# Altium schematic sheet bigMama.SchDoc: bigMama constant current breakout
size A4; DrawnBy: dermitza; Revision: 0.2; SheetNumber: 1; SheetTotal: 1; DocumentFullPathAndName: -
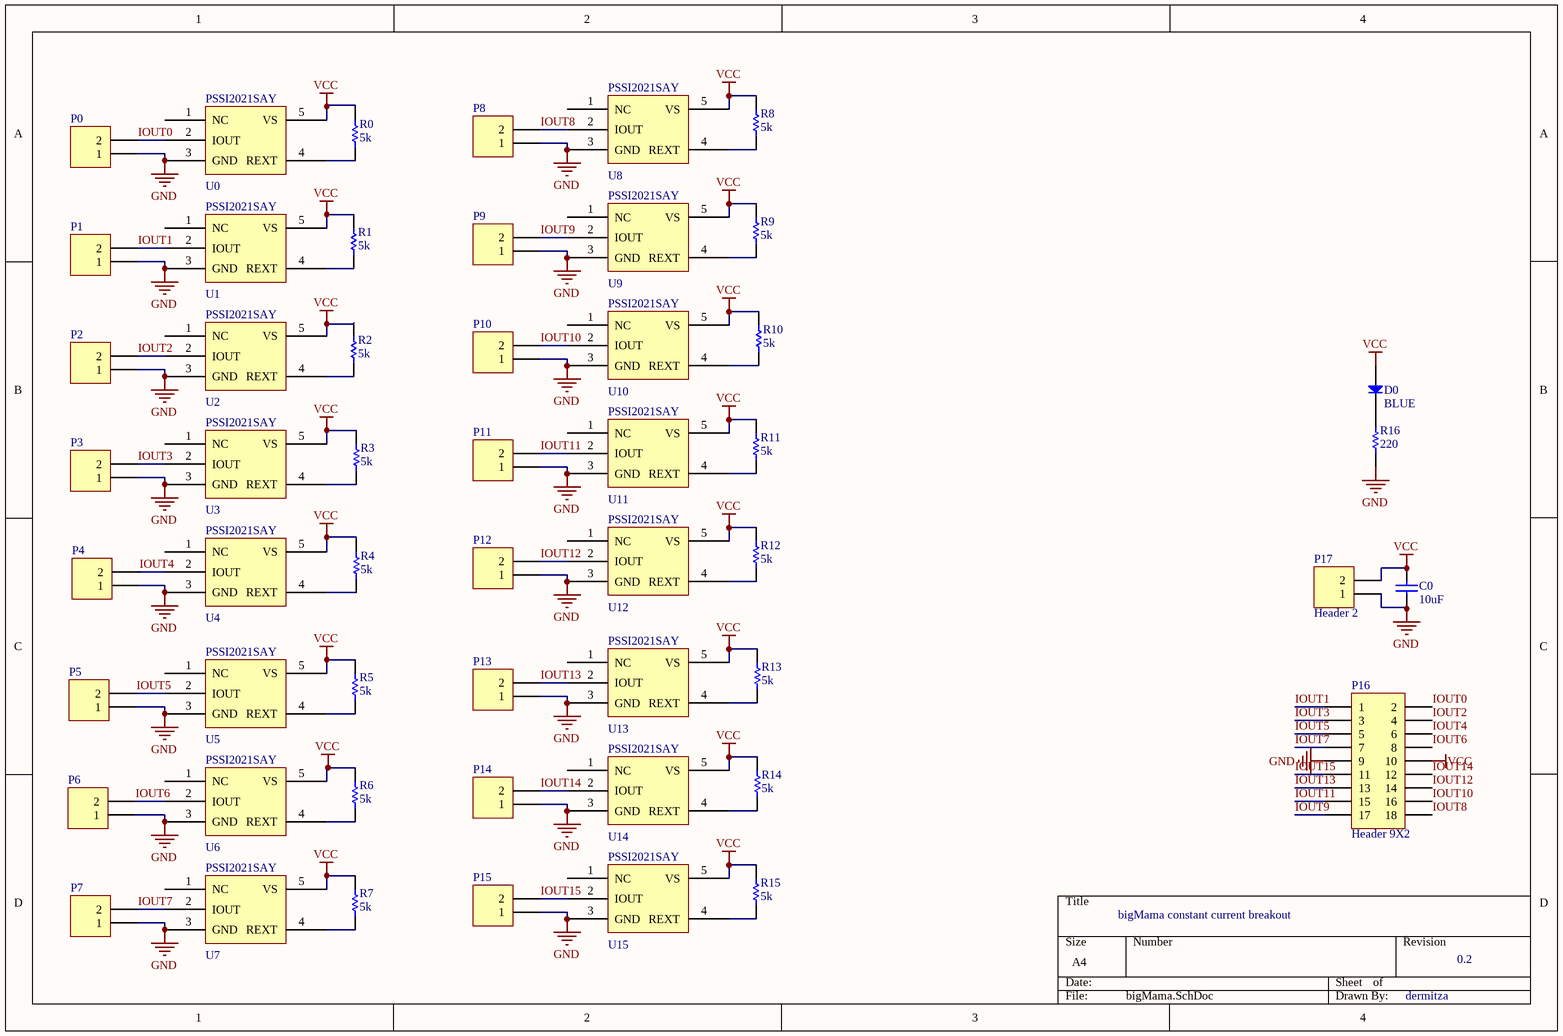
[diagram p0: bigMama.SchDoc]

## Parts
C0  10uF  [0805_CAP]
D0  BLUE  [0603_LED]
P0  S0  [HDR1X2]  (value not drawn)
P1  S0  [HDR1X2]  (value not drawn)
P2  S0  [HDR1X2]  (value not drawn)
P3  S0  [HDR1X2]  (value not drawn)
P4  S0  [HDR1X2]  (value not drawn)
P5  S0  [HDR1X2]  (value not drawn)
P6  S0  [HDR1X2]  (value not drawn)
P7  S0  [HDR1X2]  (value not drawn)
P8  S0  [HDR1X2]  (value not drawn)
P9  S0  [HDR1X2]  (value not drawn)
P10  S0  [HDR1X2]  (value not drawn)
P11  S0  [HDR1X2]  (value not drawn)
P12  S0  [HDR1X2]  (value not drawn)
P13  S0  [HDR1X2]  (value not drawn)
P14  S0  [HDR1X2]  (value not drawn)
P15  S0  [HDR1X2]  (value not drawn)
P16  Header 9X2  [HDR2X9]
P17  Header 2  [HDR1X2]
R0  5k  [0603_RES]
R1  5k  [0603_RES]
R2  5k  [0603_RES]
R3  5k  [0603_RES]
R4  5k  [0603_RES]
R5  5k  [0603_RES]
R6  5k  [0603_RES]
R7  5k  [0603_RES]
R8  5k  [0603_RES]
R9  5k  [0603_RES]
R10  5k  [0603_RES]
R11  5k  [0603_RES]
R12  5k  [0603_RES]
R13  5k  [0603_RES]
R14  5k  [0603_RES]
R15  5k  [0603_RES]
R16  220  [0603_RES]
U0  PSSI2021SAY  [SOT65P210X110-5N]  (value not drawn)
U1  PSSI2021SAY  [SOT65P210X110-5N]  (value not drawn)
U2  PSSI2021SAY  [SOT65P210X110-5N]  (value not drawn)
U3  PSSI2021SAY  [SOT65P210X110-5N]  (value not drawn)
U4  PSSI2021SAY  [SOT65P210X110-5N]  (value not drawn)
U5  PSSI2021SAY  [SOT65P210X110-5N]  (value not drawn)
U6  PSSI2021SAY  [SOT65P210X110-5N]  (value not drawn)
U7  PSSI2021SAY  [SOT65P210X110-5N]  (value not drawn)
U8  PSSI2021SAY  [SOT65P210X110-5N]  (value not drawn)
U9  PSSI2021SAY  [SOT65P210X110-5N]  (value not drawn)
U10  PSSI2021SAY  [SOT65P210X110-5N]  (value not drawn)
U11  PSSI2021SAY  [SOT65P210X110-5N]  (value not drawn)
U12  PSSI2021SAY  [SOT65P210X110-5N]  (value not drawn)
U13  PSSI2021SAY  [SOT65P210X110-5N]  (value not drawn)
U14  PSSI2021SAY  [SOT65P210X110-5N]  (value not drawn)
U15  PSSI2021SAY  [SOT65P210X110-5N]  (value not drawn)

## Nets
GND: C0.1 P0.1 P1.1 P2.1 P3.1 P4.1 P5.1 P6.1 P7.1 P8.1 P9.1 P10.1 P11.1 P12.1 P13.1 P14.1 P15.1 P16.9 P17.1 R16.1 U0.3(GND) U1.3(GND) U2.3(GND) U3.3(GND) U4.3(GND) U5.3(GND) U6.3(GND) U7.3(GND) U8.3(GND) U9.3(GND) U10.3(GND) U11.3(GND) U12.3(GND) U13.3(GND) U14.3(GND) U15.3(GND)
VCC: C0.2 D0.1(A) P16.10 P17.2 R0.2 R1.2 R2.2 R3.2 R4.2 R5.2 R6.2 R7.2 R8.2 R9.2 R10.2 R11.2 R12.2 R13.2 R14.2 R15.2 U0.5(VS) U1.5(VS) U2.5(VS) U3.5(VS) U4.5(VS) U5.5(VS) U6.5(VS) U7.5(VS) U8.5(VS) U9.5(VS) U10.5(VS) U11.5(VS) U12.5(VS) U13.5(VS) U14.5(VS) U15.5(VS)
IOUT0: P0.2 P16.2 U0.2(IOUT)
IOUT1: P1.2 P16.1 U1.2(IOUT)
IOUT2: P2.2 P16.4 U2.2(IOUT)
IOUT3: P3.2 P16.3 U3.2(IOUT)
IOUT4: P4.2 P16.6 U4.2(IOUT)
IOUT5: P5.2 P16.5 U5.2(IOUT)
IOUT6: P6.2 P16.8 U6.2(IOUT)
IOUT7: P7.2 P16.7 U7.2(IOUT)
IOUT8: P8.2 P16.18 U8.2(IOUT)
IOUT9: P9.2 P16.17 U9.2(IOUT)
IOUT10: P10.2 P16.16 U10.2(IOUT)
IOUT11: P11.2 P16.15 U11.2(IOUT)
IOUT12: P12.2 P16.14 U12.2(IOUT)
IOUT13: P13.2 P16.13 U13.2(IOUT)
IOUT14: P14.2 P16.12 U14.2(IOUT)
IOUT15: P15.2 P16.11 U15.2(IOUT)
NetD0_2: D0.2(K) R16.2
NetR0_1: R0.1 U0.4(REXT)
NetR1_1: R1.1 U1.4(REXT)
NetR2_1: R2.1 U2.4(REXT)
NetR3_1: R3.1 U3.4(REXT)
NetR4_1: R4.1 U4.4(REXT)
NetR5_1: R5.1 U5.4(REXT)
NetR6_1: R6.1 U6.4(REXT)
NetR7_1: R7.1 U7.4(REXT)
NetR8_1: R8.1 U8.4(REXT)
NetR9_1: R9.1 U9.4(REXT)
NetR10_1: R10.1 U10.4(REXT)
NetR11_1: R11.1 U11.4(REXT)
NetR12_1: R12.1 U12.4(REXT)
NetR13_1: R13.1 U13.4(REXT)
NetR14_1: R14.1 U14.4(REXT)
NetR15_1: R15.1 U15.4(REXT)

Not connected (* = marked no-connect by the designer): U0 1(NC); U1 1(NC); U2 1(NC); U3 1(NC); U4 1(NC); U5 1(NC); U6 1(NC); U7 1(NC); U8 1(NC); U9 1(NC); U10 1(NC); U11 1(NC); U12 1(NC); U13 1(NC); U14 1(NC); U15 1(NC)

## Library data of the parts
C0 = CAP_SMD: Chip Capacitor
D0 = LED_SMD
P0-P15 P17 = Header 2: Header, 2-Pin; LatestRevisionDate: 17-Jul-2002; LatestRevisionNote: Re-released for DXP Platform.; Publisher: Altium Limited
P16 = Header 9X2: Header, 9-Pin, Dual row; LatestRevisionDate: 17-Jul-2002; LatestRevisionNote: Re-released for DXP Platform.; Publisher: Altium Limited
R0-R16 = RES_SMD